# EAGLE schematic Yantronix_ECG_Alpha (EAGLE 5.10)
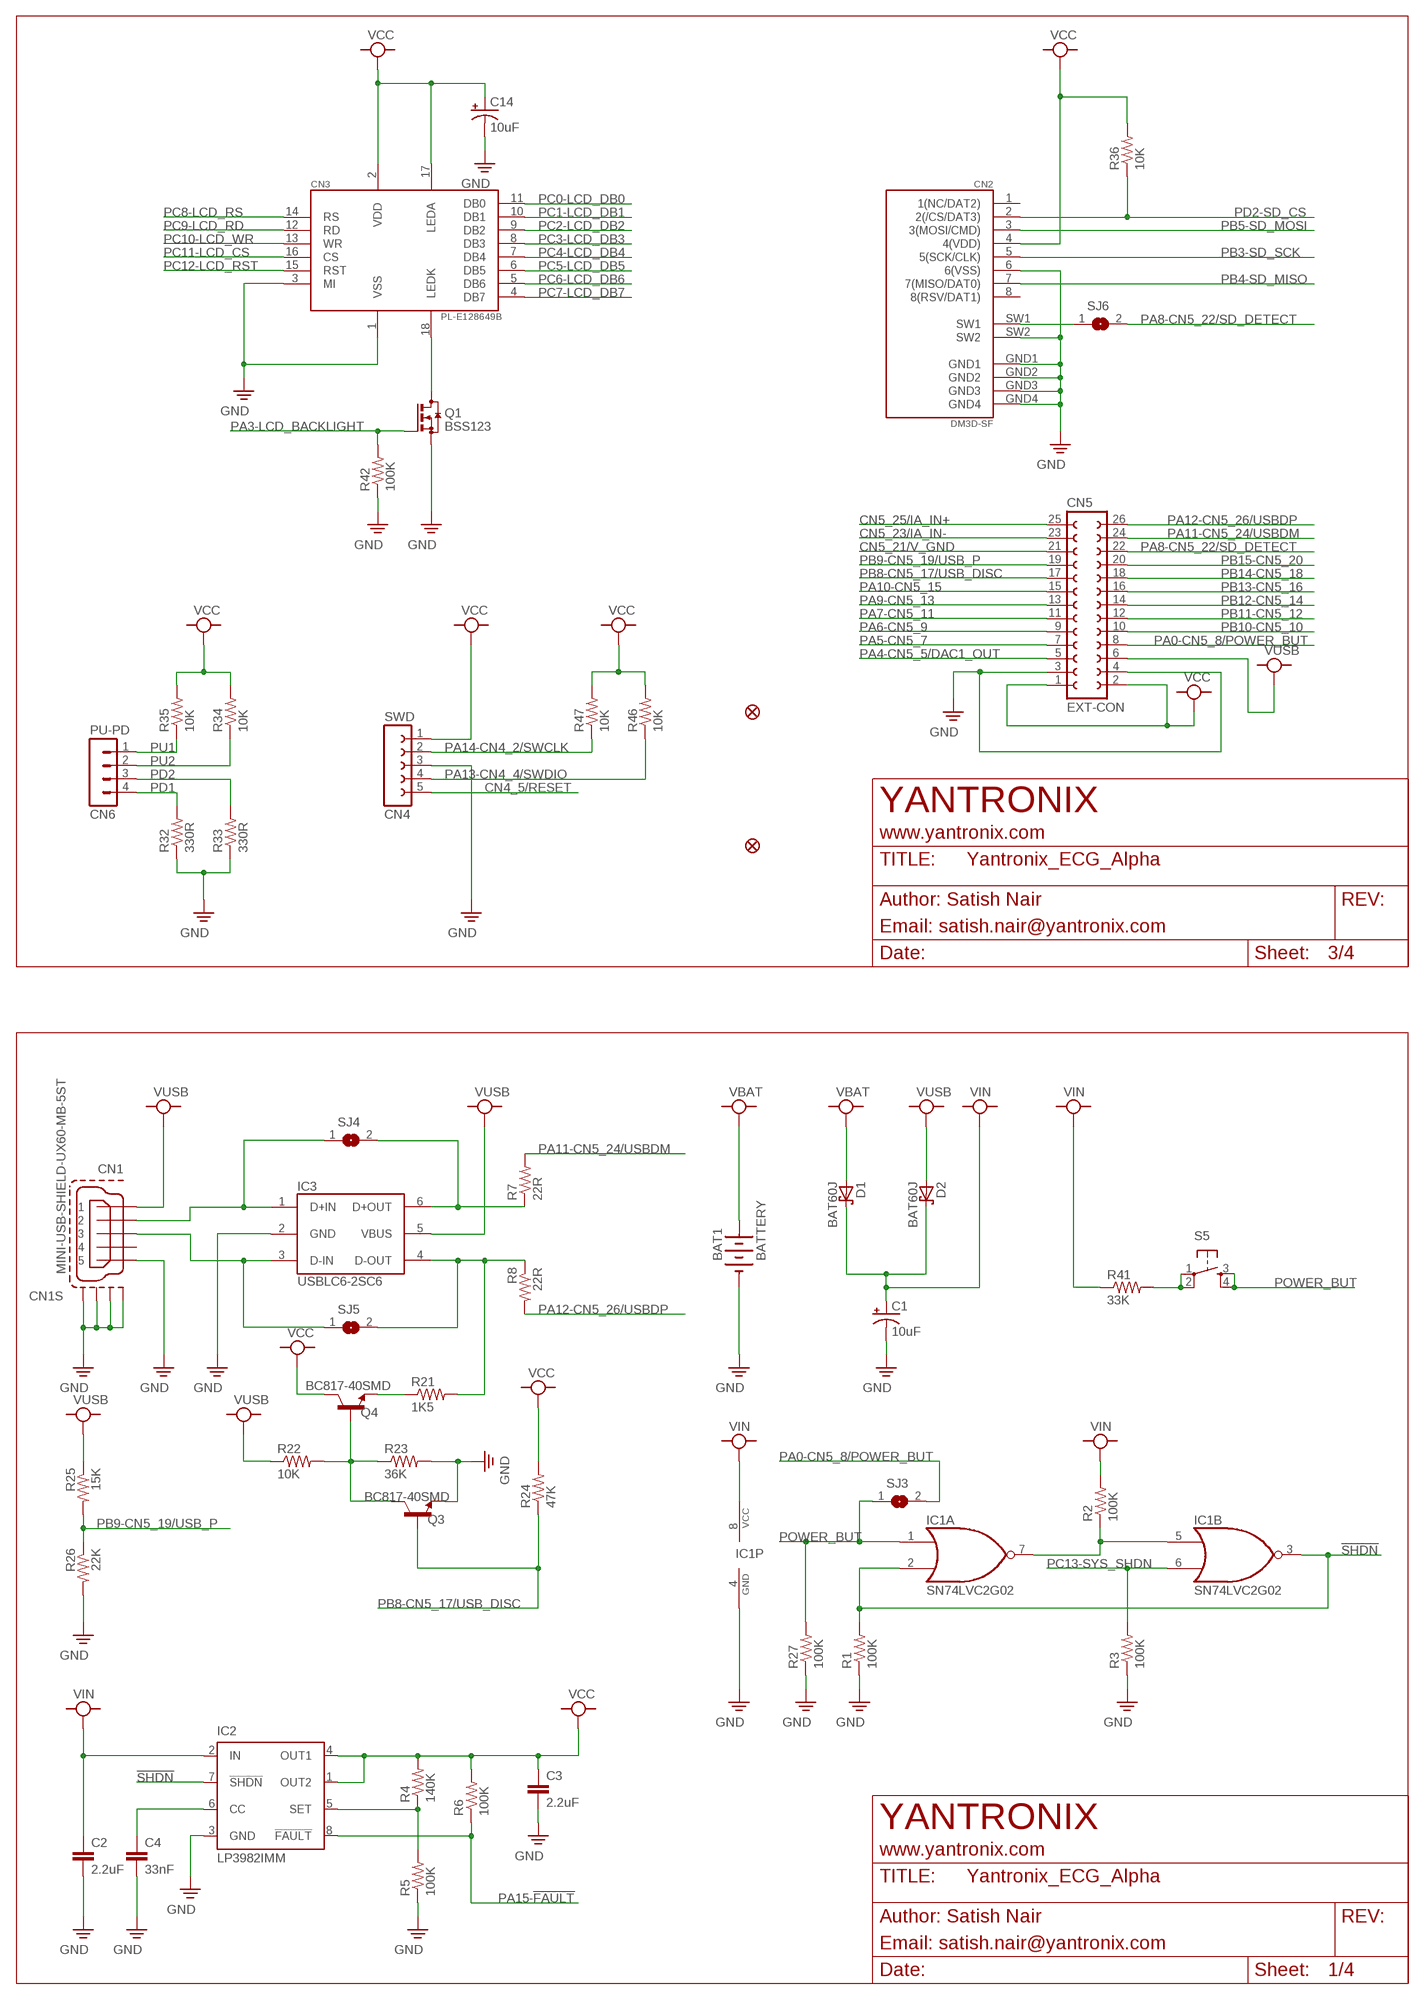
[diagram p0: schematic, sheet 1, part 1 of 2]
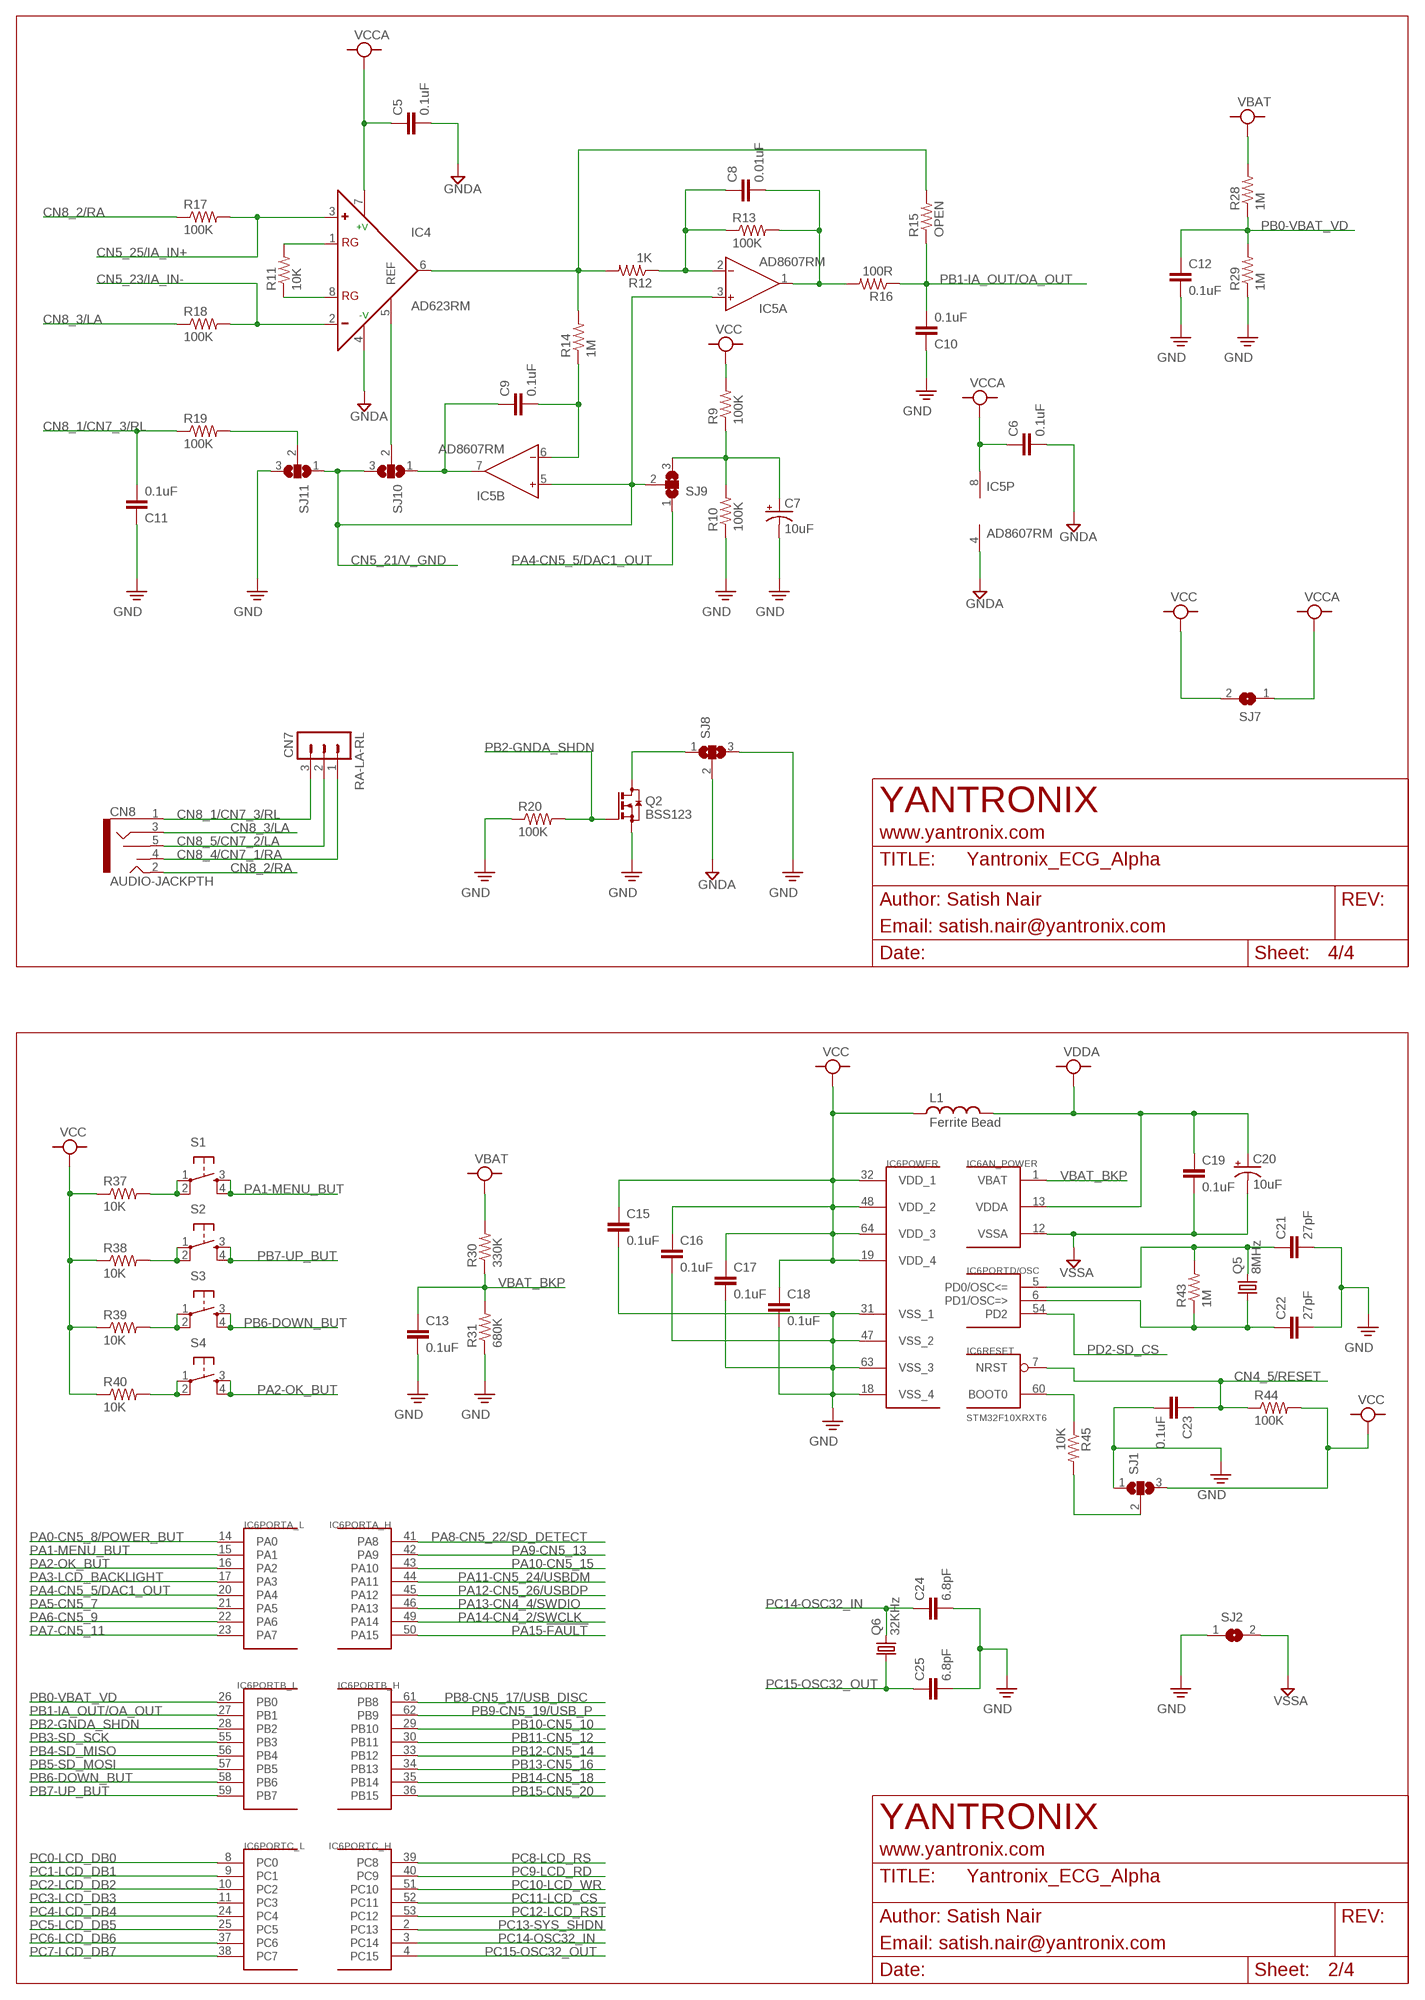
[diagram p1: schematic, sheet 1, part 2 of 2]

## Parts
BAT1  BATTERY  [BATTERY]
C1  10uF  POL-CAPACITOR1206  [EIA3216]
C2  2.2uF  CAPACITOR0805  [0805]
C3  2.2uF  CAPACITOR0805  [0805]
C4  33nF  CAPACITOR0805  [0805]
C5  0.1uF  CAPACITOR0805  [0805]
C6  0.1uF  CAPACITOR0805  [0805]
C7  10uF  POL-CAPACITOR1206  [EIA3216]
C8  0.01uF  CAPACITOR0805  [0805]
C9  0.1uF  CAPACITOR0805  [0805]
C10  0.1uF  CAPACITOR0805  [0805]
C11  0.1uF  CAPACITOR0805  [0805]
C12  0.1uF  CAPACITOR0805  [0805]
C13  0.1uF  CAPACITOR0805  [0805]
C14  10uF  POL-CAPACITOR1206  [EIA3216]
C15  0.1uF  CAPACITOR0805  [0805]
C16  0.1uF  CAPACITOR0805  [0805]
C17  0.1uF  CAPACITOR0805  [0805]
C18  0.1uF  CAPACITOR0805  [0805]
C19  0.1uF  CAPACITOR0805  [0805]
C20  10uF  POL-CAPACITOR1206  [EIA3216]
C21  27pF  CAPACITOR0805  [0805]
C22  27pF  CAPACITOR0805  [0805]
C23  0.1uF  CAPACITOR0805  [0805]
C24  6.8pF  CAPACITOR0805  [0805]
C25  6.8pF  CAPACITOR0805  [0805]
CN1  MINI-USB-SHIELD-UX60-MB-5ST  [UX60-MB-5ST]
CN2  DM3D-SF  [MICROSD-CONN-PUSH-PULL]
CN3  PL-E128649B  [LCD-CONN-128X64]
CN4  SWD  FE05W  [FE05W]
CN5  EXT-CON  FE13-2W  [FE13-2W]
CN6  PU-PD  MA04-1  [MA04-1]
CN7  RA-LA-RL  MA03-1  [MA03-1]
CN8  AUDIO-JACKPTH  [AUDIO-JACK]
D1  BAT60J  [SOD-323]
D2  BAT60J  [SOD-323]
IC1  SN74LVC2G02  [DCT_R-PDSO-G8]
IC2  LP3982IMM  [MSOP08]
IC3  USBLC6-2SC6  [SOT23-6]
IC4  AD623RM  [MSOP08]
IC5  AD8607RM  [MSOP08]
IC6  STM32F10XRXT6  [TQFP64]
JP1  FIDUCIAL1.5X3  [FIDUCIAL-1.5X3]
JP2  FIDUCIAL1.5X3  [FIDUCIAL-1.5X3]
L1  Ferrite Bead  INDUCTOR0805  [0805]
Q1  BSS123  [SOT23]
Q2  BSS123  [SOT23]
Q3  BC817-40SMD  [SOT23-BEC]
Q4  BC817-40SMD  [SOT23-BEC]
Q5  8MHz  CRYSTALHC49S  [HC49/S]
Q6  32KHz  CRYSTALTC26H  [TC26H]
R1  100K  RESISTOR0805  [0805]
R2  100K  RESISTOR0805  [0805]
R3  100K  RESISTOR0805  [0805]
R4  140K  RESISTOR0805  [0805]
R5  100K  RESISTOR0805  [0805]
R6  100K  RESISTOR0805  [0805]
R7  22R  RESISTOR0805  [0805]
R8  22R  RESISTOR0805  [0805]
R9  100K  RESISTOR0805  [0805]
R10  100K  RESISTOR0805  [0805]
R11  10K  RESISTOR0805  [0805]
R12  1K  RESISTOR0805  [0805]
R13  100K  RESISTOR0805  [0805]
R14  1M  RESISTOR0805  [0805]
R15  OPEN  RESISTOR0805  [0805]
R16  100R  RESISTOR0805  [0805]
R17  100K  RESISTOR0805  [0805]
R18  100K  RESISTOR0805  [0805]
R19  100K  RESISTOR0805  [0805]
R20  100K  RESISTOR0805  [0805]
R21  1K5  RESISTOR0805  [0805]
R22  10K  RESISTOR0805  [0805]
R23  36K  RESISTOR0805  [0805]
R24  47K  RESISTOR0805  [0805]
R25  15K  RESISTOR0805  [0805]
R26  22K  RESISTOR0805  [0805]
R27  100K  RESISTOR0805  [0805]
R28  1M  RESISTOR0805  [0805]
R29  1M  RESISTOR0805  [0805]
R30  330K  RESISTOR0805  [0805]
R31  680K  RESISTOR0805  [0805]
R32  330R  RESISTOR0805  [0805]
R33  330R  RESISTOR0805  [0805]
R34  10K  RESISTOR0805  [0805]
R35  10K  RESISTOR0805  [0805]
R36  10K  RESISTOR0805  [0805]
R37  10K  RESISTOR0805  [0805]
R38  10K  RESISTOR0805  [0805]
R39  10K  RESISTOR0805  [0805]
R40  10K  RESISTOR0805  [0805]
R41  33K  RESISTOR0805  [0805]
R42  100K  RESISTOR0805  [0805]
R43  1M  RESISTOR0805  [0805]
R44  100K  RESISTOR0805  [0805]
R45  10K  RESISTOR0805  [0805]
R46  10K  RESISTOR0805  [0805]
R47  10K  RESISTOR0805  [0805]
S1  TAC-SWITCHPTH  [TACTILE-PTH]
S2  TAC-SWITCHPTH  [TACTILE-PTH]
S3  TAC-SWITCHPTH  [TACTILE-PTH]
S4  TAC-SWITCHPTH  [TACTILE-PTH]
S5  TAC-SWITCHPTH  [TACTILE-PTH]
SJ1  SJ2W  [SJ-2]
SJ2  SJ  [SJ]
SJ3  SJ  [SJ]
SJ4  SJ  [SJ]
SJ5  SJ  [SJ]
SJ6  SJ  [SJ]
SJ7  SJ  [SJ]
SJ8  SJ2W  [SJ-2]
SJ9  SJ2W  [SJ-2]
SJ10  SJ2W  [SJ-2]
SJ11  SJ2W  [SJ-2]

## Nets
!SHDN: IC1.2(A:I2) IC1.3(B:O) IC2.7(!SHDN) R1.2
CN4_5/RESET: C23.1 CN4.5 IC6.7(RESET:NRST) R44.1
CN5_21/V_GND: CN5.21 IC5.3(A:IN+) IC5.5(B:IN+) SJ9.2 SJ10.3 SJ11.1
CN5_23/IA_IN-: CN5.23 IC4.2(-) R18.2
CN5_25/IA_IN+: CN5.25 IC4.3(+) R17.2
CN8_1/CN7_3/RL: C11.2 CN7.3 CN8.1 R19.1
CN8_2/RA: CN8.2 R17.1
CN8_3/LA: CN8.3 R18.1
CN8_4/CN7_1/RA: CN7.1 CN8.4
CN8_5/CN7_2/LA: CN7.2 CN8.5
GND: BAT1.- C1.C(-) C2.2 C3.2 C4.2 C7.C(-) C10.1 C11.1 C12.2 C13.2 C14.C(-) C15.2 C16.2 C17.2 C18.2 C21.2 C22.2 C23.2 C24.2 C25.2 CN1.5 CN1.M1(S1) CN1.M2(S2) CN1.M3(S3) CN1.M4(S4) CN2.6(6(VSS)) CN2.GND1 CN2.GND2 CN2.GND3 CN2.GND4 CN2.SW2 CN3.1(VSS) CN3.3(MI) CN4.3 CN5.3 CN5.4 IC1.4(P:GND) IC2.3(GND) IC3.2(GND) IC6.18(POWER:VSS_4) IC6.31(POWER:VSS_1) IC6.47(POWER:VSS_2) IC6.63(POWER:VSS_3) Q1.2(S) Q2.2(S) Q3.E R1.1 R3.1 R5.1 R10.1 R20.1 R23.2 R26.2 R27.1 R29.1 R31.1 R32.1 R33.1 R42.1 SJ1.1 SJ2.1 SJ8.3 SJ11.3
GNDA: C5.2 C6.2 IC4.4(-V) IC5.4(P:V-) SJ8.2
N$1: C4.1 IC2.6(CC)
N$2: IC1.5(B:I1) IC1.7(A:O) R2.1
N$3: IC2.5(SET) R4.1 R5.2
N$4: CN1.2 IC3.1(D+IN) SJ4.1
N$5: CN1.3 IC3.3(D-IN) SJ5.1
N$6: IC3.6(D+OUT) R7.1 SJ4.2
N$7: IC4.1(RG) R11.2
N$8: IC4.8(RG) R11.1
N$9: R37.2 S1.1 S1.2
N$10: R38.2 S2.1 S2.2
N$11: IC4.6(OUT) R12.2 R14.2 R15.2
N$12: C8.1 IC5.2(A:IN-) R12.1 R13.1
N$13: C9.2 IC5.6(B:IN-) R14.1
N$14: C9.1 IC5.7(B:OUT) SJ10.1
N$15: IC4.5(REF) SJ10.2
N$16: C8.2 IC5.1(A:OUT) R13.2 R16.2
N$17: R39.2 S3.1 S3.2
N$18: C7.A(+) R9.1 R10.2 SJ9.3
N$19: Q2.3(D) SJ8.1
N$20: Q3.C Q4.B R22.2 R23.1
N$21: R40.2 S4.1 S4.2
N$22: R19.2 SJ11.2
N$23: Q4.E R21.1
N$25: R41.2 S5.1 S5.2
N$28: C22.1 IC6.6(PORTD/OSC:PD1/OSC=>) Q5.1 R43.1
N$29: IC6.60(RESET:BOOT0) R45.1
N$30: C21.1 IC6.5(PORTD/OSC:PD0/OSC<=) Q5.2 R43.2
N$43: R45.2 SJ1.2
N$47: CN2.SW1 SJ6.1
N$62: CN3.18(LEDK) Q1.3(D)
PA0-CN5_8/POWER_BUT: CN5.8 IC6.14(PORTA_L:PA0) SJ3.2
PA1-MENU_BUT: IC6.15(PORTA_L:PA1) S1.3 S1.4
PA2-OK_BUT: IC6.16(PORTA_L:PA2) S4.3 S4.4
PA3-LCD_BACKLIGHT: IC6.17(PORTA_L:PA3) Q1.1(G) R42.2
PA4-CN5_5/DAC1_OUT: CN5.5 IC6.20(PORTA_L:PA4) SJ9.1
PA5-CN5_7: CN5.7 IC6.21(PORTA_L:PA5)
PA6-CN5_9: CN5.9 IC6.22(PORTA_L:PA6)
PA7-CN5_11: CN5.11 IC6.23(PORTA_L:PA7)
PA8-CN5_22/SD_DETECT: CN5.22 IC6.41(PORTA_H:PA8) SJ6.2
PA9-CN5_13: CN5.13 IC6.42(PORTA_H:PA9)
PA10-CN5_15: CN5.15 IC6.43(PORTA_H:PA10)
PA11-CN5_24/USBDM: CN5.24 IC6.44(PORTA_H:PA11) R7.2
PA12-CN5_26/USBDP: CN5.26 IC6.45(PORTA_H:PA12) R8.2
PA13-CN4_4/SWDIO: CN4.4 IC6.46(PORTA_H:PA13) R46.1
PA14-CN4_2/SWCLK: CN4.2 IC6.49(PORTA_H:PA14) R47.1
PA15-!FAULT: IC2.8(!FAULT) IC6.50(PORTA_H:PA15) R6.1
PB0-VBAT_VD: C12.1 IC6.26(PORTB_L:PB0) R28.1 R29.2
PB1-IA_OUT/OA_OUT: C10.2 IC6.27(PORTB_L:PB1) R15.1 R16.1
PB2-GNDA_SHDN: IC6.28(PORTB_L:PB2) Q2.1(G) R20.2
PB3-SD_SCK: CN2.5(5(SCK/CLK)) IC6.55(PORTB_L:PB3)
PB4-SD_MISO: CN2.7(7(MISO/DAT0)) IC6.56(PORTB_L:PB4)
PB5-SD_MOSI: CN2.3(3(MOSI/CMD)) IC6.57(PORTB_L:PB5)
PB6-DOWN_BUT: IC6.58(PORTB_L:PB6) S3.3 S3.4
PB7-UP_BUT: IC6.59(PORTB_L:PB7) S2.3 S2.4
PB8-CN5_17/USB_DISC: CN5.17 IC6.61(PORTB_H:PB8) Q3.B R24.1
PB9-CN5_19/USB_P: CN5.19 IC6.62(PORTB_H:PB9) R25.2 R26.1
PB10-CN5_10: CN5.10 IC6.29(PORTB_H:PB10)
PB11-CN5_12: CN5.12 IC6.30(PORTB_H:PB11)
PB12-CN5_14: CN5.14 IC6.33(PORTB_H:PB12)
PB13-CN5_16: CN5.16 IC6.34(PORTB_H:PB13)
PB14-CN5_18: CN5.18 IC6.35(PORTB_H:PB14)
PB15-CN5_20: CN5.20 IC6.36(PORTB_H:PB15)
PC0-LCD_DB0: CN3.11(DB0) IC6.8(PORTC_L:PC0)
PC1-LCD_DB1: CN3.10(DB1) IC6.9(PORTC_L:PC1)
PC2-LCD_DB2: CN3.9(DB2) IC6.10(PORTC_L:PC2)
PC3-LCD_DB3: CN3.8(DB3) IC6.11(PORTC_L:PC3)
PC4-LCD_DB4: CN3.7(DB4) IC6.24(PORTC_L:PC4)
PC5-LCD_DB5: CN3.6(DB5) IC6.25(PORTC_L:PC5)
PC6-LCD_DB6: CN3.5(DB6) IC6.37(PORTC_L:PC6)
PC7-LCD_DB7: CN3.4(DB7) IC6.38(PORTC_L:PC7)
PC8-LCD_RS: CN3.14(RS) IC6.39(PORTC_H:PC8)
PC9-LCD_RD: CN3.12(RD) IC6.40(PORTC_H:PC9)
PC10-LCD_WR: CN3.13(WR) IC6.51(PORTC_H:PC10)
PC11-LCD_CS: CN3.16(CS) IC6.52(PORTC_H:PC11)
PC12-LCD_RST: CN3.15(RST) IC6.53(PORTC_H:PC12)
PC13-SYS_SHDN: IC1.6(B:I2) IC6.2(PORTC_H:PC13) R3.2
PC14-OSC32_IN: C24.1 IC6.3(PORTC_H:PC14) Q6.2
PC15-OSC32_OUT: C25.1 IC6.4(PORTC_H:PC15) Q6.1
PD1: CN6.4 R32.2
PD2: CN6.3 R33.2
PD2-SD_CS: CN2.2(2(/CS/DAT3)) IC6.54(PORTD/OSC:PD2) R36.1
POWER_BUT: IC1.1(A:I1) R27.2 S5.3 S5.4 SJ3.1
PU1: CN6.1 R35.1
PU2: CN6.2 R34.1
USB-DP: IC3.4(D-OUT) R8.1 R21.2 SJ5.2
VBAT: BAT1.+ D1.A R28.2 R30.2
VBAT_BKP: C13.1 IC6.1(AN_POWER:VBAT) R30.1 R31.2
VCC: C3.1 C14.A(+) C15.1 C16.1 C17.1 C18.1 CN2.4(4(VDD)) CN3.2(VDD) CN3.17(LEDA) CN4.1 CN5.1 CN5.2 IC2.1(OUT2) IC2.4(OUT1) IC6.19(POWER:VDD_4) IC6.32(POWER:VDD_1) IC6.48(POWER:VDD_2) IC6.64(POWER:VDD_3) L1.1 Q4.C R4.2 R6.2 R9.2 R24.2 R34.2 R35.2 R36.2 R37.1 R38.1 R39.1 R40.1 R44.2 R46.2 R47.2 SJ1.3 SJ7.2
VCCA: C5.1 C6.1 IC4.7(+V) IC5.8(P:V+) SJ7.1
VDDA: C19.1 C20.A(+) IC6.13(AN_POWER:VDDA) L1.2
VIN: C1.A(+) C2.1 D1.K D2.K IC1.8(P:VCC) IC2.2(IN) R2.2 R41.1
VSSA: C19.2 C20.C(-) IC6.12(AN_POWER:VSSA) SJ2.2
VUSB: CN1.1 CN5.6 D2.A IC3.5(VBUS) R22.1 R25.1
Unconnected: CN1.4 CN2.1(1(NC/DAT2)) CN2.8(8(RSV/DAT1))

## Notes on the sheet
- 3/4 | 4/4
- 1/4 | 2/4

## Library data of the parts
BAT1 = yantronix:BATTERY: NC ACCU Varta
C1 C7 C14 C20 = yantronix:POL-CAPACITOR: Capacitor Polarized Standard 1206 SMD capacitor. Normally 10uF, 47uF, and 100uF in electrolytic and tantalum varieties.
C2-C6 C8-C13 C15-C19 C21-C25 = yantronix:CAPACITOR: Capacitor Standard 0603, 0805 and 1206 ceramic smd capacitors.
CN1 = yantronix:MINI-USB-SHIELD-: MINI USB Connector Source: http://www.hirose.co.jp/cataloge_hp/e24000019.pdf
CN2 = yantronix:DM3D-SF: Hirose's DM3D series MicroSD card connector(Push-Pull, manual, without ejection mechanism) used on Yantronix Boards.
CN3 = yantronix:PL-E128649B: POWER LIGHT - 128X64 COG GRAPHICS LCD MODULE (PL-E128649B-FFSESW)
CN4 = yantronix:FE05W: FEMALE HEADER
CN5 = yantronix:FE13-2W: FEMALE HEADER
CN6 = yantronix:MA04-1: PIN HEADER
CN7 = yantronix:MA03-1: PIN HEADER
CN8 = yantronix:AUDIO-JACK: 3.5mm AUDIO JACK STEREO
D1 D2 = yantronix:BAT60J: SMALL SIGNAL SCHOTTKY DIODE
IC1 = yantronix:SN74LVC2G02: DUAL 2-INPUT POSITIVE-NOR GATE
IC2 = yantronix:LP3982IMM: Micropower, Ultra Low-Dropout, Low-Noise, 300mA CMOS Regulator
IC3 = yantronix:USBLC6-2: Very low capacitance ESD protection
IC4 = yantronix:AD623: Single-Supply, Rail-to-Rail, Low Cost Instrumentation Amplifier Source: http://www.analog.com/static/imported-files/data_sheets/AD623.pdf
IC5 = yantronix:AD8607: Precision Micropower, Low Noise CMOS, Rail-to-Rail Input/Output Operational Amplifiers Source: http://www.analog.com/static/imported-files/data_sheets/AD8603_8607_8609.pdf
IC6 = yantronix:STM32F10XRXT6: STM32F101/103 64pin LQFP
JP1 JP2 = yantronix:FIDUCIAL: Fiducial Alignment Points Fiducial point for machine vision alignment.
L1 = yantronix:INDUCTOR: Inductors Standard 0603, 0805 and 1206 smd inductors/ferrite beads.
Q1 Q2 = yantronix:BSS123: N-CHANNEL MOS FET
Q3 Q4 = yantronix:BC817*: NPN Transistor
Q5 Q6 = yantronix:CRYSTAL: CRYSTAL
R1-R47 = yantronix:RESISTOR: Resistor Standard 0603, 0805 and 1206 smd resistors.
S1-S5 = yantronix:TAC-SWITCH: Momentary Switch Button commonly used for reset or general input. Spark Fun Electronics SKU : COM-00097
SJ1 SJ8-SJ11 = yantronix:SJ2W: SMD solder JUMPER
SJ2-SJ7 = yantronix:SJ: SMD solder JUMPER